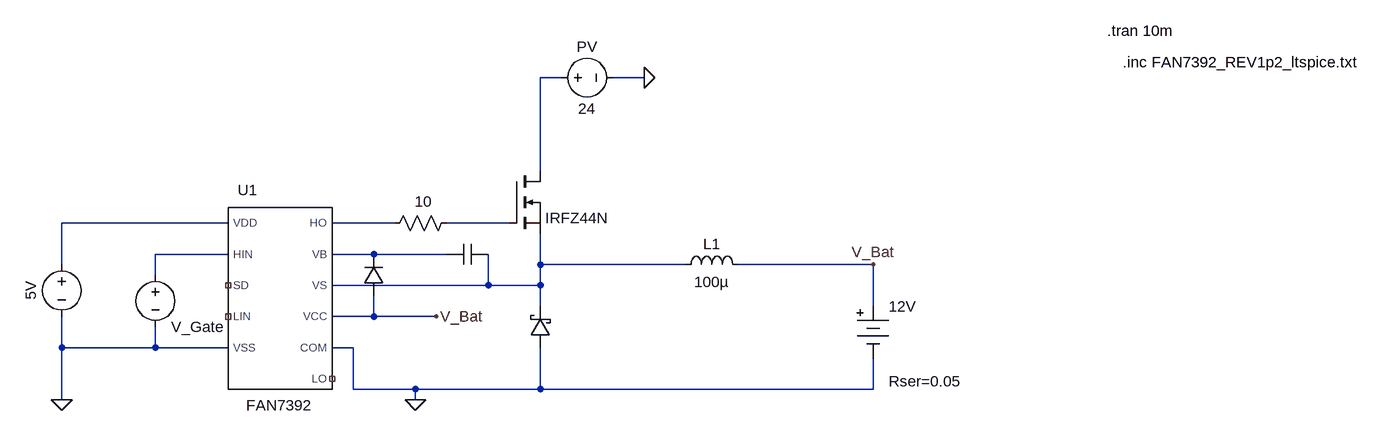
[diagram p0: schematic Bootstrapping.asc]
Bootstrapping.asc, the LTspice schematic file:
Version 4
SHEET 1 1896 680
WIRE 640 -176 608 -176
WIRE 768 -176 720 -176
WIRE 608 -32 608 -176
WIRE 128 48 -128 48
WIRE 384 48 288 48
WIRE 560 48 464 48
WIRE 128 96 16 96
WIRE 352 96 288 96
WIRE 464 96 352 96
WIRE -128 112 -128 48
WIRE 608 112 608 64
WIRE 832 112 608 112
WIRE 1120 112 912 112
WIRE 16 128 16 96
WIRE 528 144 528 96
WIRE 528 144 288 144
WIRE 608 144 608 112
WIRE 608 144 528 144
WIRE 608 176 608 144
WIRE 1120 176 1120 112
WIRE 352 192 352 160
WIRE 352 192 288 192
WIRE 448 192 352 192
WIRE -128 240 -128 192
WIRE 16 240 16 208
WIRE 16 240 -128 240
WIRE 128 240 16 240
WIRE 320 240 288 240
WIRE 320 304 320 240
WIRE 416 304 320 304
WIRE 608 304 608 240
WIRE 608 304 416 304
WIRE 1120 304 1120 256
WIRE 1120 304 608 304
WIRE -128 320 -128 240
WIRE 416 320 416 304
FLAG 416 320 0
FLAG 768 -176 0
FLAG -128 320 0
FLAG 1120 112 V_Bat
FLAG 448 192 V_Bat
SYMBOL Gate\ drivers\\FAN7392 208 160 R0
SYMATTR InstName U1
SYMBOL nmos 560 -32 R0
WINDOW 0 56 32 Invisible 2
SYMATTR InstName M1
SYMATTR Value IRFZ44N
SYMBOL res 480 32 R90
WINDOW 0 0 56 Invisible 2
WINDOW 3 -33 52 VTop 2
SYMATTR InstName R1
SYMATTR Value 10
SYMBOL ind 816 128 R270
WINDOW 0 32 56 VTop 2
WINDOW 3 5 56 VBottom 2
SYMATTR InstName L1
SYMATTR Value 100µ
SYMBOL cap 528 80 R90
WINDOW 0 0 32 Invisible 2
WINDOW 3 32 32 Invisible 2
SYMATTR InstName C1
SYMATTR Value 1µF
SYMBOL voltage 624 -176 R270
WINDOW 0 32 56 VTop 2
WINDOW 3 -32 56 VBottom 2
WINDOW 123 0 0 Left 0
WINDOW 39 0 0 Left 0
SYMATTR InstName PV
SYMATTR Value 24
SYMBOL voltage -128 96 R0
WINDOW 0 32 56 Invisible 2
WINDOW 3 -32 56 VBottom 2
WINDOW 123 0 0 Left 0
WINDOW 39 0 0 Left 0
SYMATTR InstName V3
SYMATTR Value 5V
SYMBOL voltage 16 112 R0
WINDOW 0 24 16 Invisible 2
WINDOW 123 0 0 Left 0
WINDOW 39 0 0 Left 0
SYMATTR InstName V4
SYMATTR Value V_Gate
SYMBOL diode 368 160 R180
WINDOW 0 24 64 Invisible 2
WINDOW 3 24 0 Invisible 2
SYMATTR InstName D1
SYMATTR Value 1N4148
SYMBOL schottky 624 240 R180
WINDOW 0 24 64 Invisible 2
WINDOW 3 24 0 Invisible 2
SYMATTR InstName D2
SYMATTR Value SS3P5
SYMATTR Description Diode
SYMATTR Type diode
SYMBOL Misc\\battery 1120 160 R0
WINDOW 123 0 0 Left 0
WINDOW 39 24 132 Left 2
SYMATTR InstName 12V
SYMATTR Value ""
SYMATTR SpiceLine Rser=0.05
TEXT 1480 -248 Left 2 !.tran 10m
TEXT 1504 -200 Left 2 !.inc FAN7392_REV1p2_ltspice.txt

The netlist it stands for:
* Bootstrapping.asc
XU1 V_Bat 0 N005 NC_01 N002 N006 N007 N003 0 NC_02 NC_03 FAN7392  ; pins VCC COM HIN LIN VDD VB VS HO VSS SD LO
M1 N001 N004 N007 N007 IRFZ44N
R1 N004 N003 10
L1 N007 V_Bat 100µ
C1 N007 N006 1µF
V§PV N001 0 24
V3 N002 0 5V
V4 N005 0 V_Gate
D1 V_Bat N006 1N4148
D2 0 N007 SS3P5
V§12V V_Bat 0 Rser=0.05
.model D D
.lib standard.dio
.model NMOS NMOS
.model PMOS PMOS
.lib standard.mos
.tran 10m
.inc FAN7392_REV1p2_ltspice.txt
.backanno
.end